# EAGLE schematic bp_pic_programmer_v1 (EAGLE 5.07)
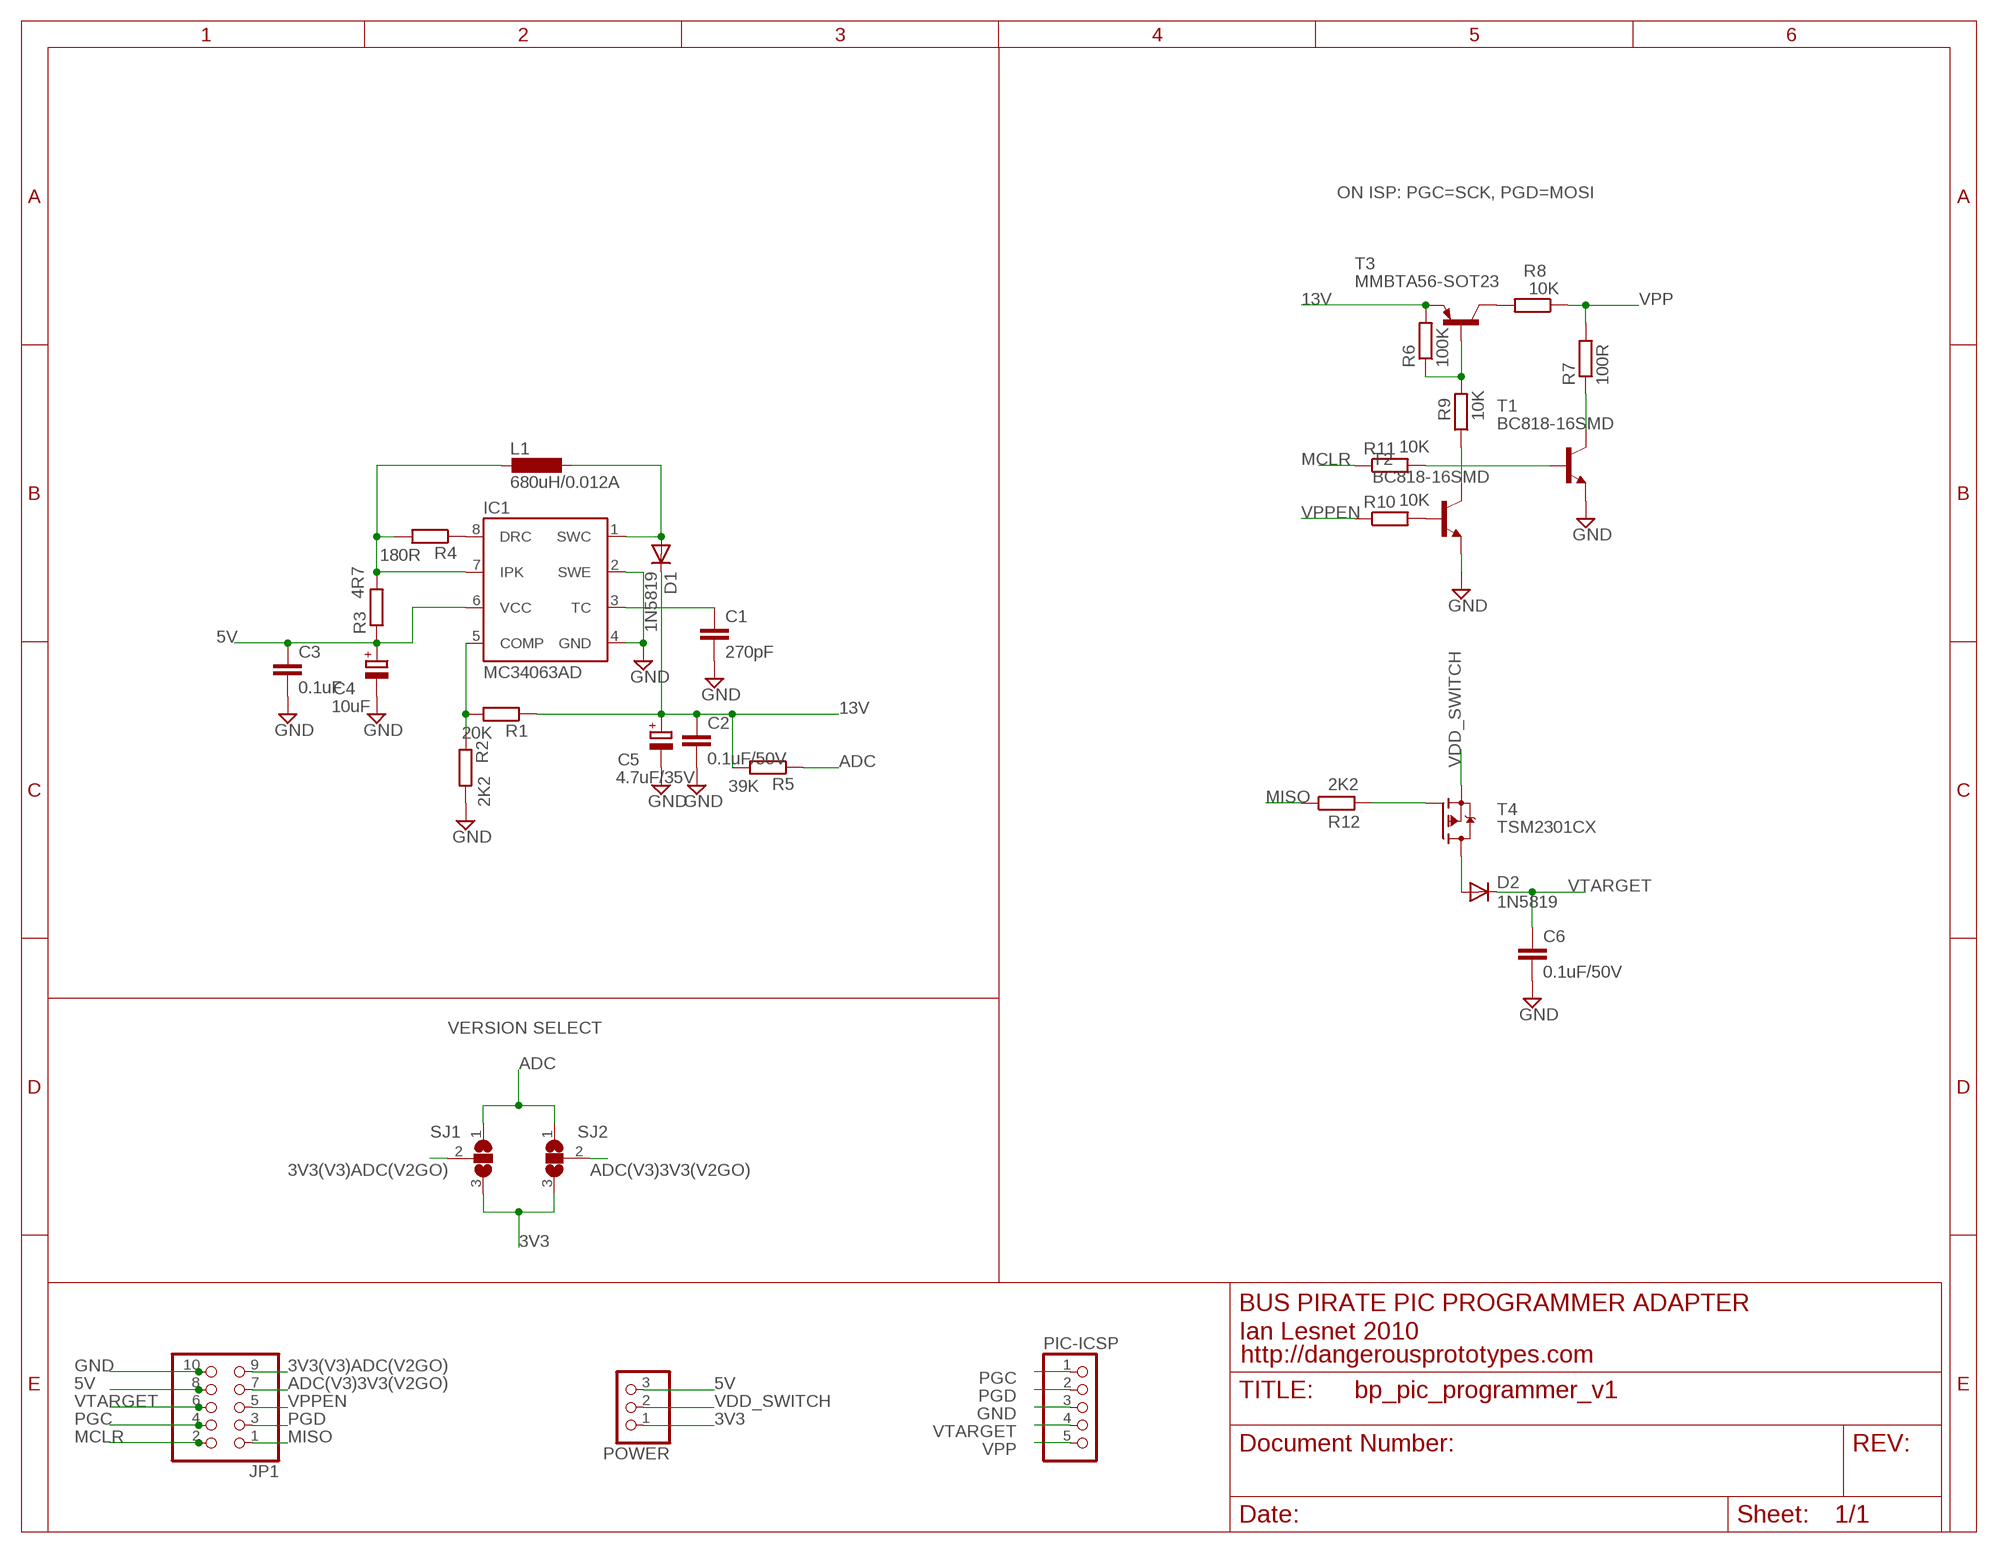
[diagram p0: schematic, sheet 1]

## Parts
C1  270pF  C-EUC0805K  [C0805K]
C2  0.1uF/50V  C-EUC0805K  [C0805K]
C3  0.1uF  C-EUC0805K  [C0805K]
C4  10uF  CPOL-EUSMCA  [SMC_A]
C5  4.7uF/35V  CPOL-EUSANYO_SMD_A5  [SANYO-OSCON_SMD_A5]
C6  0.1uF/50V  C-EUC0805K  [C0805K]
D1  1N5819  MBR0520LT  [SOD123]
D2  1N5819  MBR0520LT  [SOD123]
IC1  MC34063AD  [SO08]
JP1  PINHD-2X5  [2X05]
L1  680uH/0.012A  L-EUL4532P  [L4532P]
PIC-ICSP  PINHD-1X5  [1X05]
POWER  PINHD-1X3  [1X03]
R1  20K  R-EU_M0805  [M0805]
R2  2K2  R-EU_M0805  [M0805]
R3  4R7  R-EU_M0805  [M0805]
R4  180R  R-EU_M0805  [M0805]
R5  39K  R-EU_M0805  [M0805]
R6  100K  R-EU_M0805  [M0805]
R7  100R  R-EU_M0805  [M0805]
R8  10K  R-EU_M0805  [M0805]
R9  10K  R-EU_M0805  [M0805]
R10  10K  R-EU_M0805  [M0805]
R11  10K  R-EU_M0805  [M0805]
R12  2K2  R-EU_M0805  [M0805]
SJ1  SJ2W  [SJ_2]
SJ2  SJ2W  [SJ_2]
T1  BC818-16SMD  [SOT23-BEC]
T2  BC818-16SMD  [SOT23-BEC]
T3  MMBTA56-SOT23  [SOT23]
T4  TSM2301CX  [SOT23]

## Nets
3V3: POWER.1 SJ1.3 SJ2.3
3V3(V3)ADC(V2GO): JP1.9 SJ1.2
5V: C3.1 C4.+ IC1.6(VCC) JP1.8 POWER.3 R3.1
13V: C2.1 C5.+ D1.C R1.1 R5.2 R6.2 T3.2(E)
ADC: R5.1 SJ1.1 SJ2.1
ADC(V3)3V3(V2GO): JP1.7 SJ2.2
GND: C1.2 C2.2 C3.2 C4.- C5.- C6.2 IC1.2(SWE) IC1.4(GND) JP1.10 PIC-ICSP.3 R2.2 T1.E T2.E
MCLR: JP1.2 R11.1
MISO: JP1.1 R12.1
N$1: R12.2 T4.1(G)
N$3: R7.1 T1.C
N$4: R8.2 T3.3(C)
N$5: R9.1 T2.C
N$6: R6.1 R9.2 T3.1(B)
N$7: R11.2 T1.B
N$8: R10.2 T2.B
N$9: IC1.8(DRC) R4.1
N$10: D2.A T4.3(D)
N$11: IC1.7(IPK) L1.2 R3.2 R4.2
N$14: IC1.5(COMP) R1.2 R2.1
N$17: D1.A IC1.1(SWC) L1.1
N$19: C1.1 IC1.3(TC)
PGC: JP1.4 PIC-ICSP.5
PGD: JP1.3 PIC-ICSP.4
VDD_SWITCH: POWER.2 T4.2(S)
VPP: PIC-ICSP.1 R7.2 R8.1
VPPEN: JP1.5 R10.1
VTARGET: C6.1 D2.C JP1.6 PIC-ICSP.2

## Notes on the sheet
- ON ISP: PGC=SCK, PGD=MOSI
- VERSION SELECT
- BUS PIRATE PIC PROGRAMMER ADAPTER
- Ian Lesnet 2010
- http://dangerousprototypes.com

## Library data of the parts
C1-C3 C6 = rcl:C-EU: CAPACITOR, European symbol
C4 C5 = rcl:CPOL-EU: POLARIZED CAPACITOR, European symbol
D1 D2 = diode:MBR0520LT: SCHOTTKY BARRIER RECTIFIER Source: http://onsemi.com .. MBR0520LT1-D.pdf
IC1 = v-reg-3:MC34063A: 1.5A Step-Up/Down/Inverting Switching Regulator NPN Darlington Switch, Vin 3V to 40V, Current Limiter Input, adjustable Frequency up to 100kHz
JP1 = pinhead-2:PINHD-2X5: PIN HEADER
L1 = rcl:L-EU: INDUCTOR, European symbol
PIC-ICSP = pinhead-2:PINHD-1X5: PIN HEADER
POWER = pinhead-2:PINHD-1X3: PIN HEADER
R1-R12 = rcl:R-EU_: RESISTOR, European symbol
SJ1 SJ2 = jumper:SJ2W: SMD solder JUMPER
T1 T2 = transistor-npn:BC818*: NPN Transistor
T3 = transistor-pnp:*-?: PNP Transistor
T4 = dp_devices:TSM2301CX: 20V P-Channel Enhancement Mode MOSFET